# EAGLE design IR (EAGLE 8.5.0)
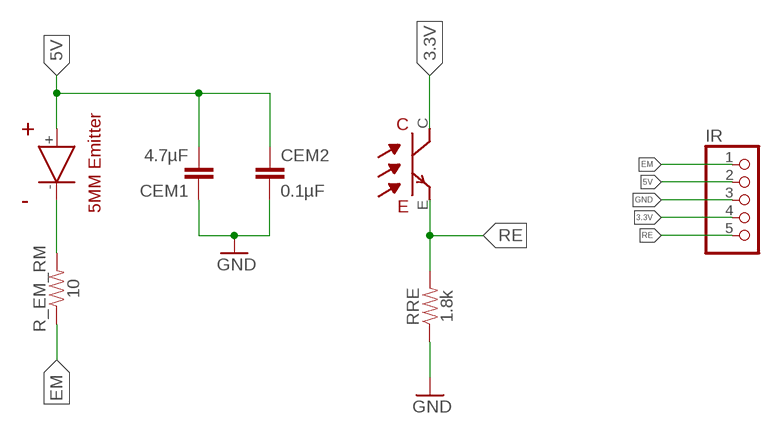
[diagram p0: schematic, sheet 1]

## Parts
CEM1  4.7µF  0.33UF/330NF-0805-50V-10%  [0805]
CEM2  0.1µF  0.33UF/330NF-0805-50V-10%  [0805]
IR  PINHD-1X5  [1X05]
R_EM_RM  10  0.75OHM-0805-1/4W-1%  [0805]
RRE  1.8k  0.75OHM-0805-1/4W-1%  [0805]
U$21  EMITTER  [EMITTER]
U$23  RECEIVER  [RECEIVER]

## Nets
3.3V: IR.4 U$23.C
5V: CEM1.2 CEM2.1 IR.2 U$21.+
EM: IR.1 R_EM_RM.1
EM-: R_EM_RM.2 U$21.-
GND: CEM1.1 CEM2.2 IR.3 RRE.1
RE: IR.5 RRE.2 U$23.E

## Library data of the parts
CEM1 CEM2 = SparkFun-Capacitors:0.33UF/330NF: 0.33µF/330nF ceramic capacitors A capacitor is a passive two-terminal electrical component used to store electrical energy temporarily in an electric field.; PROD_ID: CAP-08469; VALUE: 0.33µF
IR = pinhead:PINHD-1X5: PIN HEADER
R_EM_RM RRE = SparkFun-Resistors:0.75OHM: 0.75Ω resistor A resistor is a passive two-terminal electrical component that implements electrical resistance as a circuit element. Resistors act to reduce current flow, and, at the same time, act to lower voltage levels within circuits. - Wikipedia; PROD_ID: RES-08474; VALUE: 0.75
U$21 = sfh4550 & teft4300:EMITTER
U$23 = sfh4550 & teft4300:RECEIVER

## Board
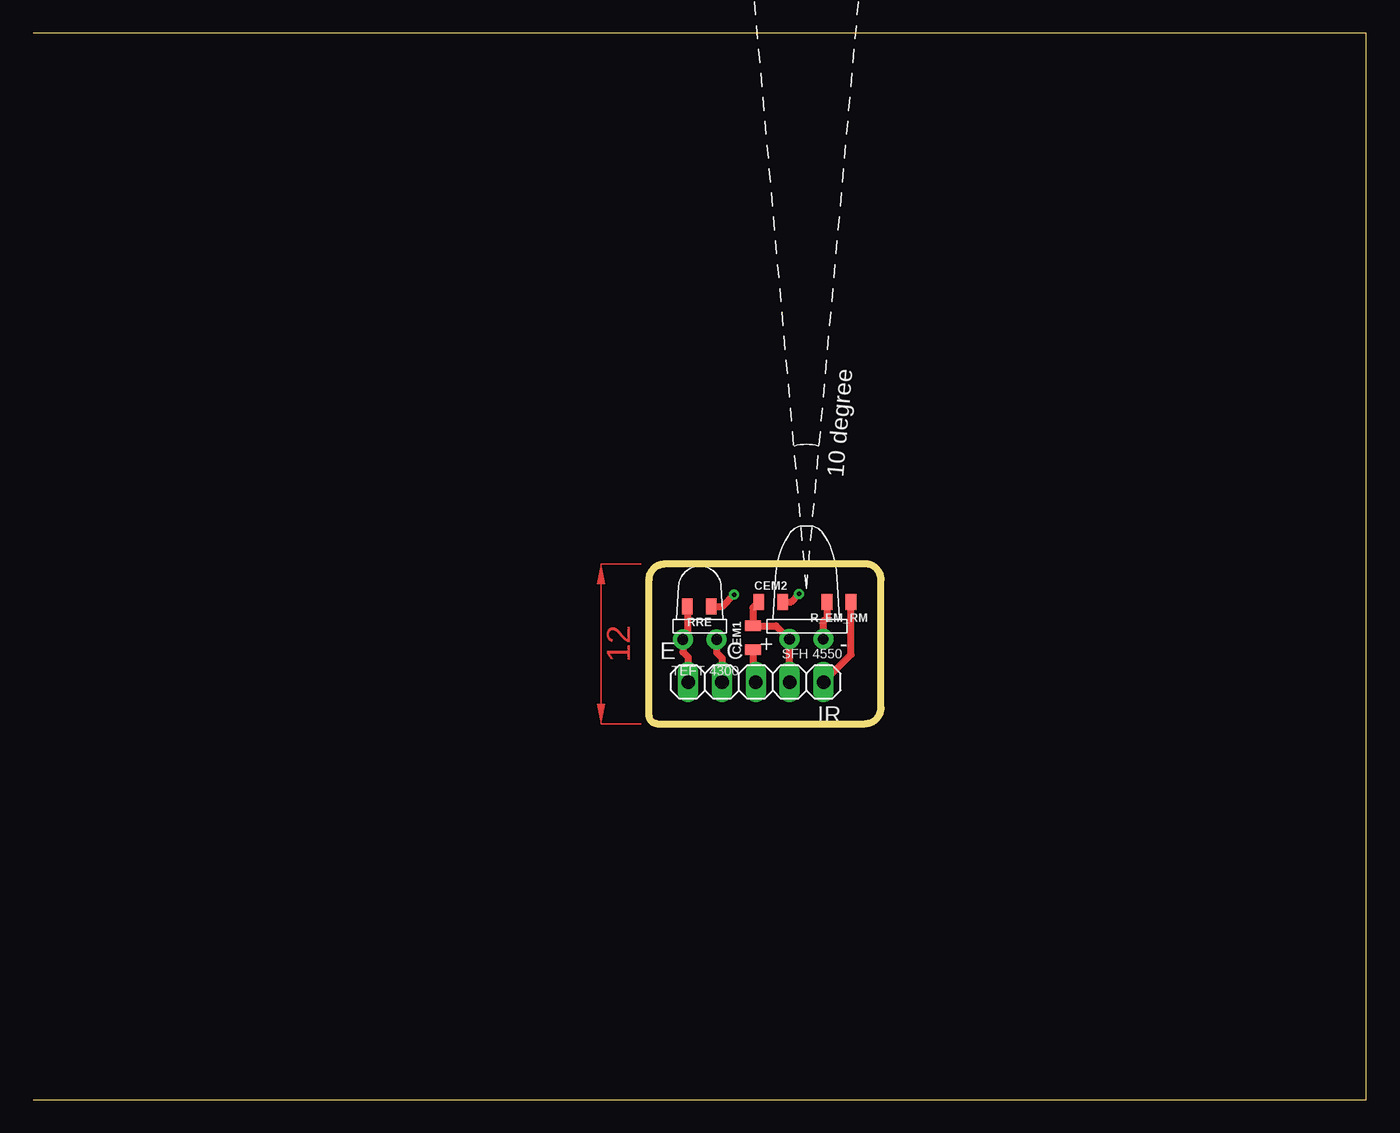
[diagram p1: board, top side]
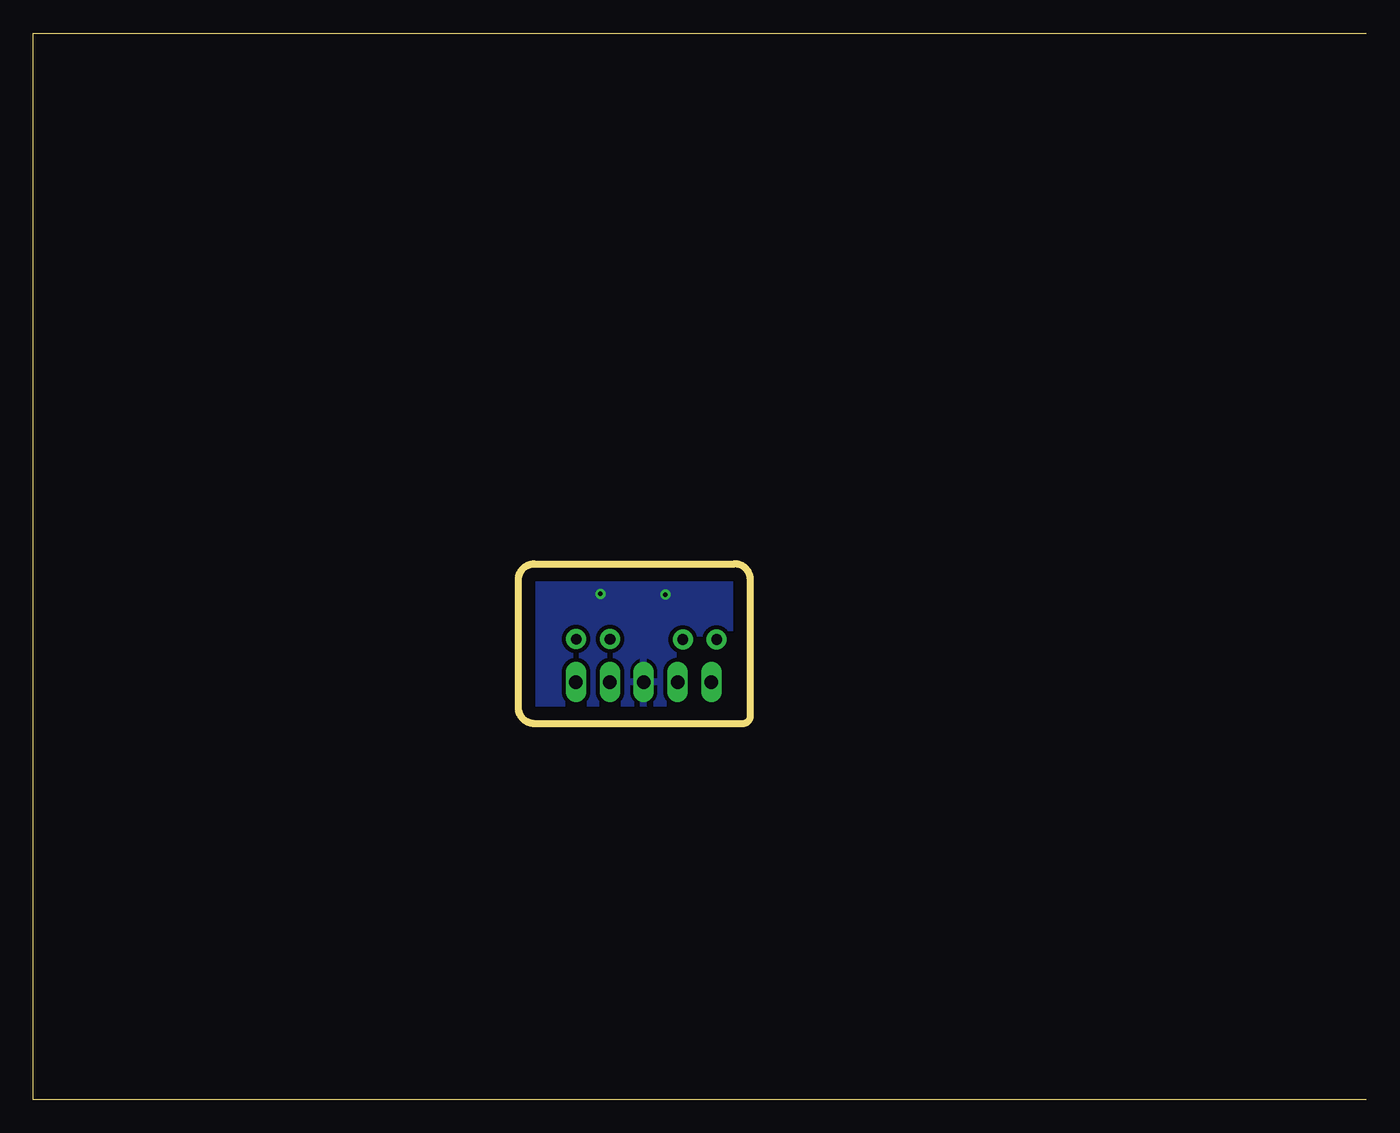
[diagram p2: board, bottom side, seen from below]

Size 100 x 80 mm. Coordinates in mm from the lower left corner, seen from the top.
Outline: 0,0 100,0 100,80 0,80
Outline: 46.8,28.2 62.4,28.2 arc90 63.6,29.4 63.6,39 arc90 62.4,40.2 47.4,40.2 arc90 46.2,39 46.2,28.8 arc90 46.8,28.2
Copper layers (1*16): Top 0.035mm / dielectric 1.5mm / Bottom 0.035mm
Design rules "default": minimum track width 6mil, minimum drill 0.35mm, track to track 6mil, track to pad 6mil, pad to pad 6mil, via to via 6mil, smd to smd 6mil, copper to edge 40mil, drill to drill 6mil, minimum pad ring 10mil, minimum via ring 8mil, stop-mask expansion 4mil, vias tented up to drill 0mil, thermal gap 10mil

### Footprints (pad centres in the part's own frame; a part is rotated, then mirrored left to right if it is on the bottom)
0805 = smd 0.8 x 1.2: 1 -0.9,0; 2 0.9,0
1X05 = drill 1.016 long: 1 -5.08,0; 2 -2.54,0; 3 0,0; 4 2.54,0; 5 5.08,0
EMITTER = drill 0.8 pad 1.5: + -1.27,-0.5; - 1.27,-0.5
RECEIVER = drill 0.8 pad 1.5: C 1.27,-0.5; E -1.27,-0.5

### Placement (x,y rotation side)
CEM1  53.99,34.65 90 top
CEM2  55.32,37.35 0 top
IR  54.21,31.33 180 top
R_EM_RM  60.45,37.33 180 top
RRE  49.97,37.01 180 top
U$21  58,35.05 0 top
U$23  50,35.02 0 top

### Tracks (layer width: path | path; a pad name or v marks a point on that pad's centre or on a via)
3.3V
  Top 0.508: U$23.C 51.27,33.53 51.68,33.12 51.68,31.34 IR.4
5V
  Top 0.508: CEM2.1 53.99,36.92 CEM1.2 55.73,35.55 U$21.+ 56.75,34.53 IR.2
EM
  Top 0.508: IR.1 61.35,33.39 R_EM_RM.1
EM-
  Top 0.508: R_EM_RM.2 59.55,36.14 59.26,35.85 59.26,34.56 U$21.-
GND  (via drill 0.35)
  Top 0.508: CEM1.1 53.99,31.55 IR.3 | RRE.1 51.7,37.01 v52.58,37.89 | CEM2.2 56.87,37.35 v57.46,37.94
  pour Bottom (isolate 0.305): 43.94,42.91 43.94,26.05 45.95,24.04 63.4,24.04 65.17,25.8 65.73,26.37 65.73,43.21 63.04,45.9 46.91,45.9 44.02,43.01 44.02,42.97
RE
  Top 0.508: IR.5 49.12,33.19 48.73,33.58 U$23.E 49.07,34.86 RRE.2
(copper drawn outside any net)
  shapes: Top area x1